# EAGLE design Locoio (EAGLE 4.03)
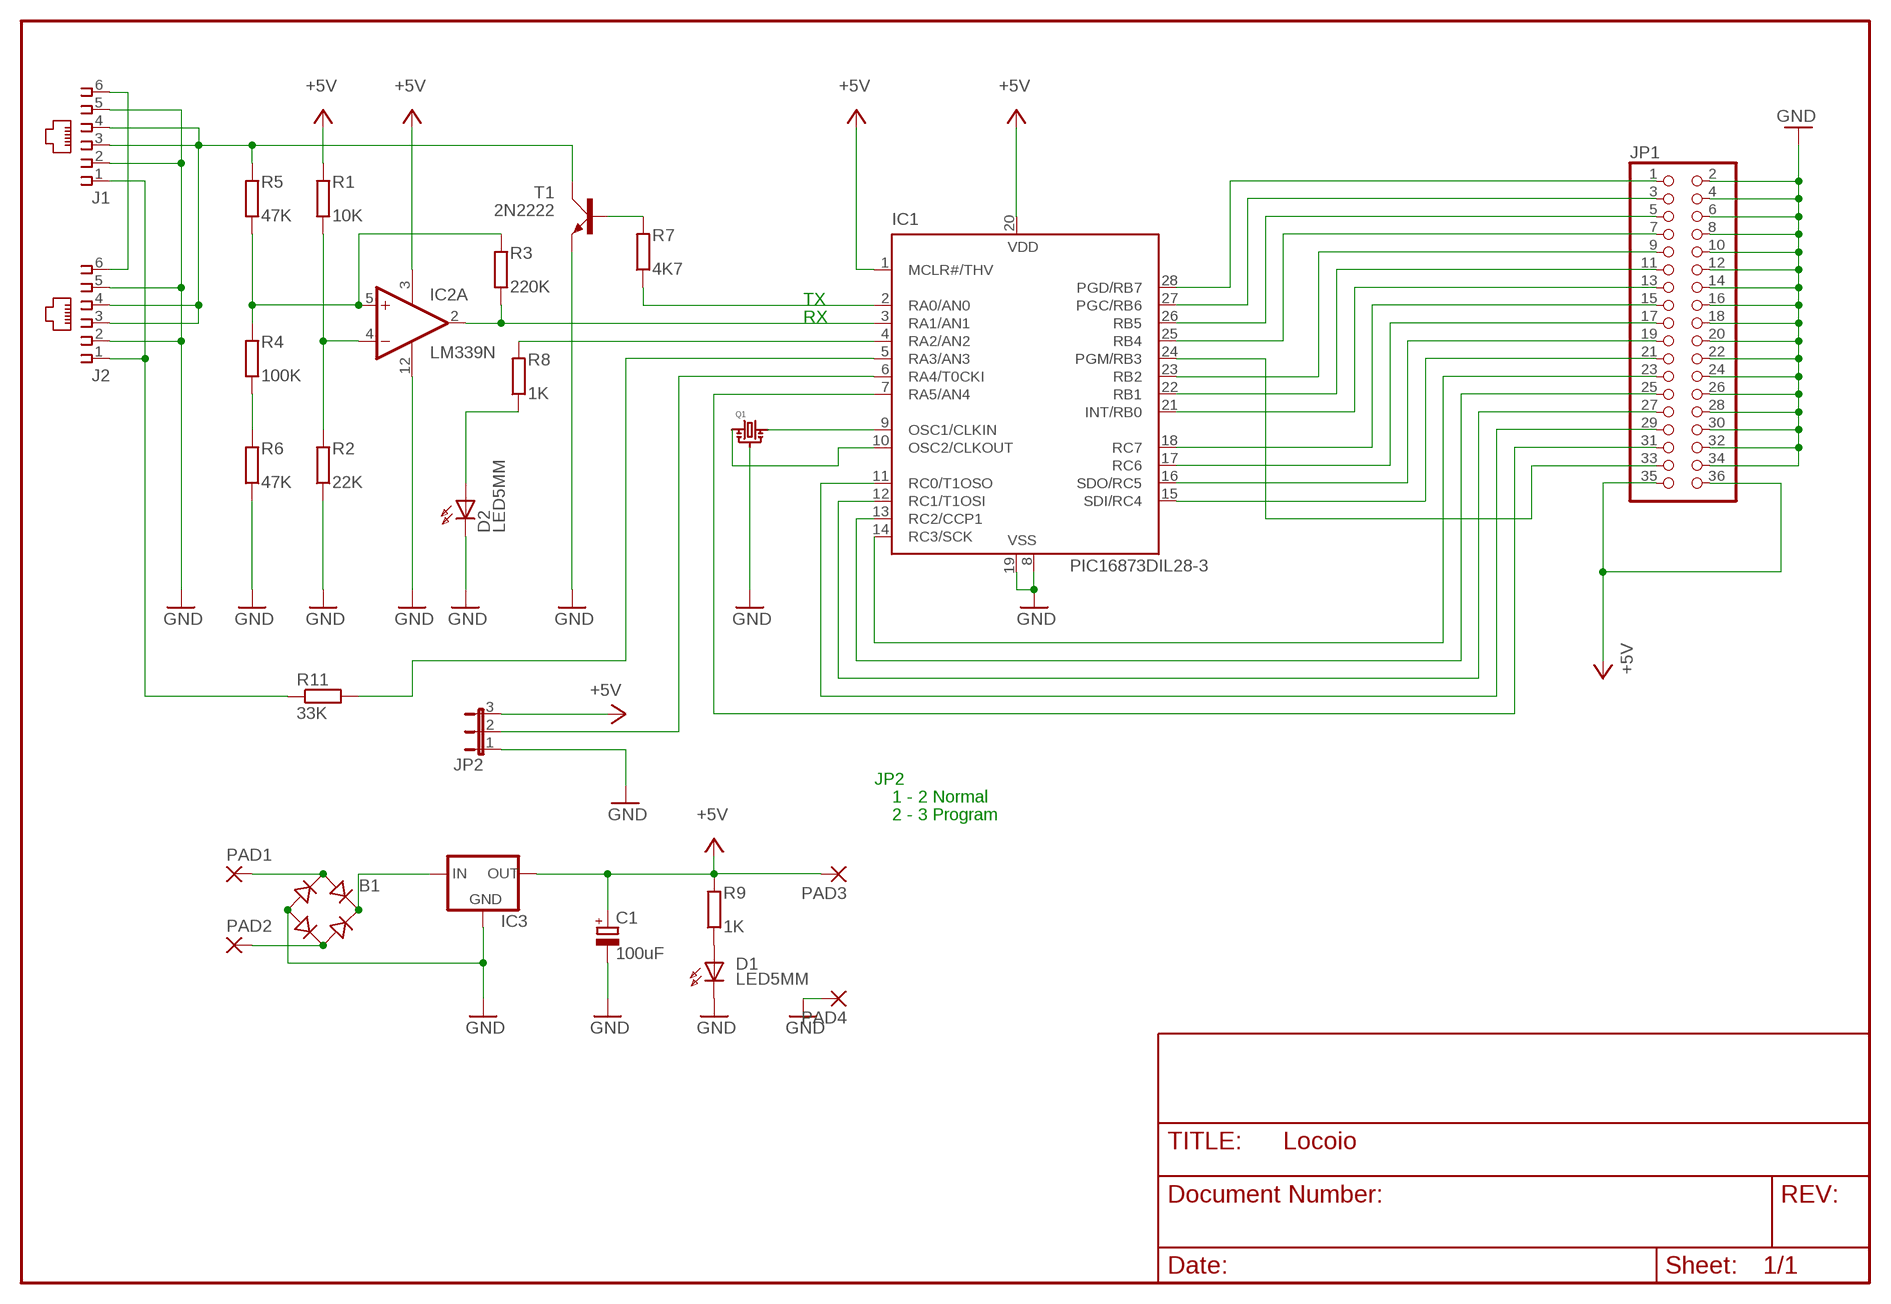
[diagram p0: schematic, sheet 1]

## Parts
B1  B-DIL  [B-DIL]
C1  100uF  CPOL-EUE2.5-7  [E2,5-7]
D1  LED5MM  [LED5MM]
D2  LED5MM  [LED5MM]
IC1  PIC16873DIL28-3  [DIL28-3]
IC2  LM339N  [DIL14]
IC3  78XXS  [78XXS]
J1  520250-3  [520250-3]
J2  520250-3  [520250-3]
JP1  PINHD-2X18  [2X18]
JP2  JP2E  [JP2]
PAD1  2,54/0,8  [2,54/0,8]
PAD2  2,54/0,8  [2,54/0,8]
PAD3  2,54/0,8  [2,54/0,8]
PAD4  2,54/0,8  [2,54/0,8]
Q1  RESOX909"  [X909-ND]
R1  10K  R-EU_0204/7  [0204/7]
R2  22K  R-EU_0204/7  [0204/7]
R3  220K  R-EU_0204/7  [0204/7]
R4  100K  R-EU_0204/7  [0204/7]
R5  47K  R-EU_0204/7  [0204/7]
R6  47K  R-EU_0204/7  [0204/7]
R7  4K7  R-EU_0204/7  [0204/7]
R8  1K  R-EU_0204/7  [0204/7]
R9  1K  R-EU_0204/7  [0204/7]
R11  33K  R-EU_0204/7  [0204/7]
T1  2N2222  [TO18A]

## Nets
+5V: C1.+ IC1.1(MCLR#/THV) IC1.20(VDD) IC2.3(P:V+) IC3.OUT JP1.35 JP1.36 JP2.3 PAD3.1(P) R1.2 R9.2
GND: B1.- C1.- D1.K(C) D2.K(C) IC1.8(VSS) IC1.19(VSS) IC2.12(P:V-) IC3.GND J1.2 J1.5 J2.2 J2.5 JP1.2 JP1.4 JP1.6 JP1.8 JP1.10 JP1.12 JP1.14 JP1.16 JP1.18 JP1.20 JP1.22 JP1.24 JP1.26 JP1.28 JP1.30 JP1.32 JP1.34 JP2.1 PAD4.1(P) Q1.P$2 R2.1 R6.1 T1.E
N$1: J1.3 J1.4 J2.3 J2.4 R5.2 T1.C
N$2: IC1.28(PGD/RB7) JP1.1
N$3: IC1.14(RC3/SCK) JP1.23
N$4: IC2.5(A:+IN) R3.2 R4.2 R5.1
N$5: R4.1 R6.2
N$6: IC1.27(PGC/RB6) JP1.3
N$7: IC2.4(A:-IN) R1.1 R2.2
N$8: IC1.26(RB5) JP1.5
N$9: R7.2 T1.B
N$10: IC1.25(RB4) JP1.7
N$11: IC1.3(RA1/AN1) IC2.2(A:OUT) R3.1
N$12: IC1.2(RA0/AN0) R7.1
N$13: J1.1 J2.1 R11.1
N$14: IC1.23(RB2) JP1.9
N$15: IC1.22(RB1) JP1.11
N$16: IC1.9(OSC1/CLKIN) Q1.P$3
N$17: IC1.10(OSC2/CLKOUT) Q1.P$1
N$18: IC1.4(RA2/AN2) R8.2
N$19: D2.A R8.1
N$20: IC1.21(INT/RB0) JP1.13
N$21: IC1.18(RC7) JP1.15
N$22: IC1.17(RC6) JP1.17
N$23: IC1.16(SDO/RC5) JP1.19
N$25: B1.+ IC3.IN
N$26: D1.A R9.1
N$27: B1.AC2 PAD2.1(P)
N$28: B1.AC1 PAD1.1(P)
N$38: IC1.15(SDI/RC4) JP1.21
N$39: IC1.13(RC2/CCP1) JP1.25
N$40: IC1.24(PGM/RB3) JP1.33
N$41: IC1.12(RC1/T1OSI) JP1.27
N$42: IC1.11(RC0/T1OSO) JP1.29
N$43: J1.6 J2.6
N$45: IC1.7(RA5/AN4) JP1.31
N$48: IC1.6(RA4/T0CKI) JP2.2
N$49: IC1.5(RA3/AN3) R11.2
Unconnected: IC2.1(B:OUT) IC2.6(B:-IN) IC2.7(B:+IN) IC2.8(C:-IN) IC2.9(C:+IN) IC2.10(D:-IN) IC2.11(D:+IN) IC2.13(D:OUT) IC2.14(C:OUT)

## Notes on the sheet
- TX
- RX
- JP2
- 1 - 2 Normal
- 2 - 3 Program

## Library data of the parts
B1 = rectifier:B-DIL: RECTIFIER
C1 = rcl:CPOL-EU: POLARIZED CAPACITOR, European symbol
D1 D2 = led:LED5MM: LED 5 mm, round
IC1 = microchip:PIC16*873: MICROCONTROLLER flash type
IC2 = linear:LM339: COMPARATOR
IC3 = v-reg:78XXS: VOLTAGE REGULATOR
J1 J2 = con-amp:520250-3: AMP CONNECTOR
JP1 = pinhead:PINHD-2X18: PIN HEADER
JP2 = jumper:JP2E: JUMPER
PAD1-PAD4 = wirepad:2,54/0,8: THROUGH-HOLE PAD
Q1 = crystal:RESOX909: Resonator X909-ND
R1-R9 R11 = rcl:R-EU_: RESISTOR, European symbol
T1 = transistor-small-signal:2N2222: NPN TRANSISTOR

## Board
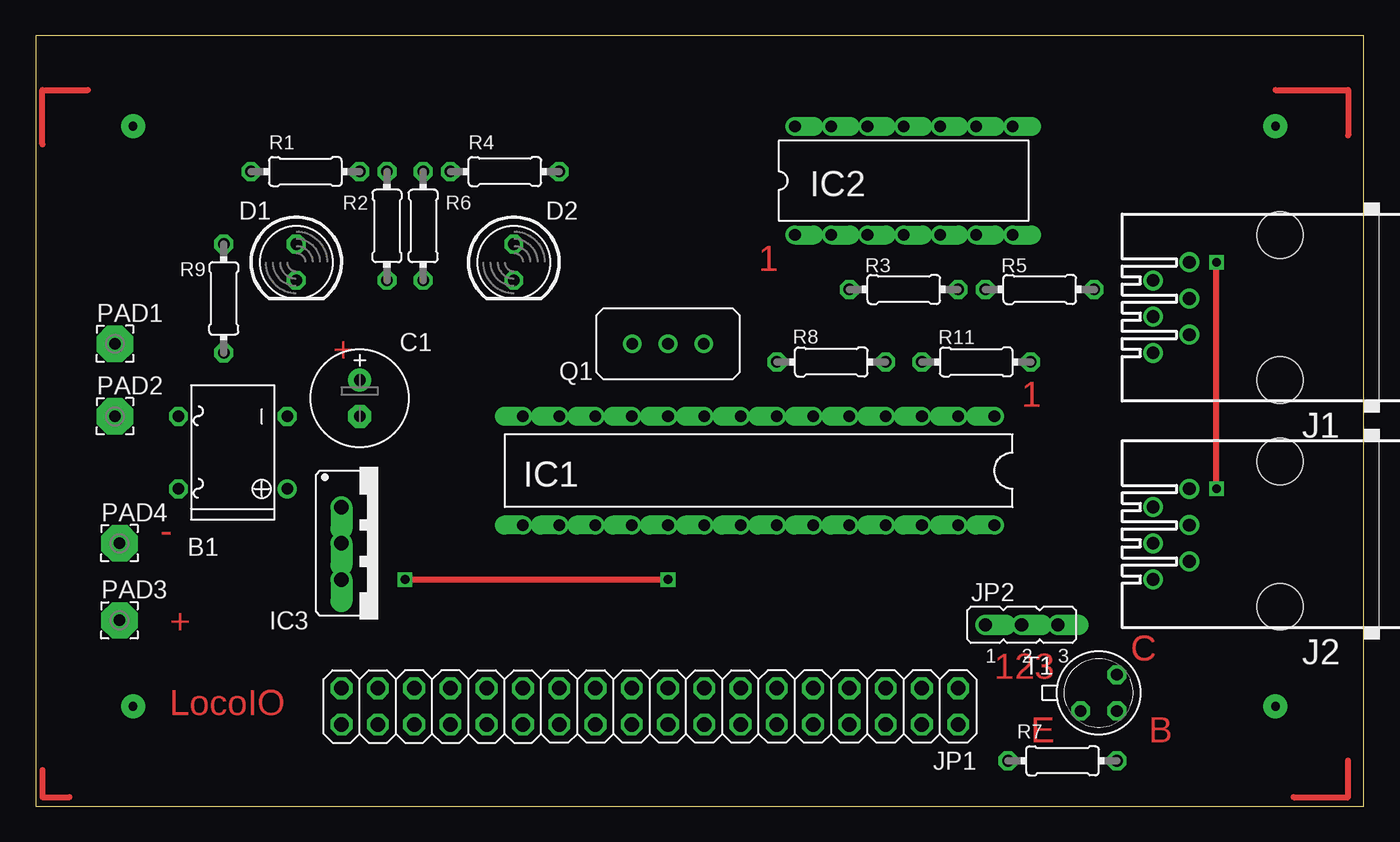
[diagram p1: board, top side]
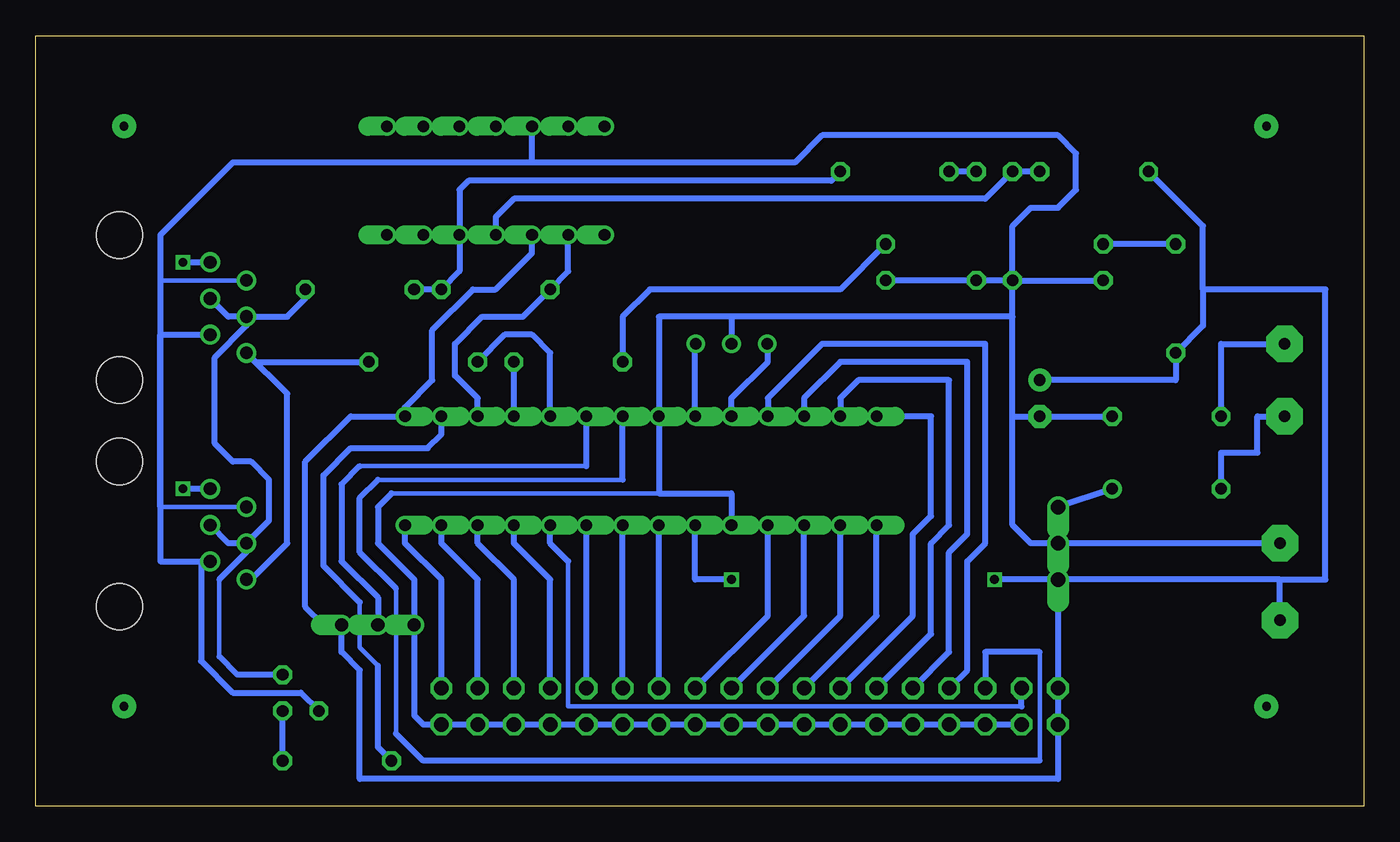
[diagram p2: board, bottom side, seen from below]

Size 93.02 x 53.97 mm. Coordinates in mm from the lower left corner, seen from the top.
Outline: 0,0 93.02,0 93.02,53.97 0,53.97 0,0
Copper layers used: Top, Bottom

### Footprints (pad centres in the part's own frame; a part is rotated, then mirrored left to right if it is on the bottom)
B-DIL = drill 0.813 round: + -2.54,-3.81 | drill 0.813 octagon: - 2.54,-3.81; AC1 2.54,3.81; AC2 -2.54,3.81
E2,5-7 = drill 0.813 pad 1.6 round: + -1.27,0 | drill 0.813 pad 1.6 octagon: - 1.27,0
LED5MM = drill 0.813 octagon: A -1.27,0; K 1.27,0
DIL28-3 = drill 0.813 offset: 1 -16.51,-3.81; 2 -13.97,-3.81; 3 -11.43,-3.81; 4 -8.89,-3.81; 5 -6.35,-3.81; 6 -3.81,-3.81; 7 -1.27,-3.81; 8 1.27,-3.81; 9 3.81,-3.81; 10 6.35,-3.81; 11 8.89,-3.81; 12 11.43,-3.81; 13 13.97,-3.81; 14 16.51,-3.81; 15 16.51,3.81; 16 13.97,3.81; 17 11.43,3.81; 18 8.89,3.81; 19 6.35,3.81; 20 3.81,3.81; 21 1.27,3.81; 22 -1.27,3.81; 23 -3.81,3.81; 24 -6.35,3.81; 25 -8.89,3.81; 26 -11.43,3.81; 27 -13.97,3.81; 28 -16.51,3.81
DIL14 = drill 0.813 offset: 1 -7.62,-3.81; 2 -5.08,-3.81; 3 -2.54,-3.81; 4 0,-3.81; 5 2.54,-3.81; 6 5.08,-3.81; 7 7.62,-3.81; 8 7.62,3.81; 9 5.08,3.81; 10 2.54,3.81; 11 0,3.81; 12 -2.54,3.81; 13 -5.08,3.81; 14 -7.62,3.81
78XXS = drill 1.016 offset: GND 0,-2.54; IN -2.54,-2.54; OUT 2.54,-2.54
520250-3 = drill 0.889 round: 1 -3.175,8.89; 2 -1.905,6.35; 3 -0.635,8.89; 4 0.635,6.35; 5 1.905,8.89; 6 3.175,6.35 | hole 3.251: -5.08,0; 5.08,0
2X18 = drill 1.016 octagon: 1 -21.59,-1.27; 2 -21.59,1.27; 3 -19.05,-1.27; 4 -19.05,1.27; 5 -16.51,-1.27; 6 -16.51,1.27; 7 -13.97,-1.27; 8 -13.97,1.27; 9 -11.43,-1.27; 10 -11.43,1.27; 11 -8.89,-1.27; 12 -8.89,1.27; 13 -6.35,-1.27; 14 -6.35,1.27; 15 -3.81,-1.27; 16 -3.81,1.27; 17 -1.27,-1.27; 18 -1.27,1.27; 19 1.27,-1.27; 20 1.27,1.27; 21 3.81,-1.27; 22 3.81,1.27; 23 6.35,-1.27; 24 6.35,1.27; 25 8.89,-1.27; 26 8.89,1.27; 27 11.43,-1.27; 28 11.43,1.27; 29 13.97,-1.27; 30 13.97,1.27; 31 16.51,-1.27; 32 16.51,1.27; 33 19.05,-1.27; 34 19.05,1.27; 35 21.59,-1.27; 36 21.59,1.27
JP2 = drill 0.914 offset: 1 -2.54,0; 2 0,0; 3 2.54,0
2,54/0,8 = drill 0.813 pad 2.54 octagon: 1 0,0
X909-ND = drill 0.813 round: P$1 -2.5,0; P$2 0,0; P$3 2.5,0
0204/7 = drill 0.813 octagon: 1 -3.81,0; 2 3.81,0
TO18A = drill 0.813 octagon: B 1.27,-1.27; C 1.27,1.27; E -1.27,-1.27

### Placement (x,y rotation side)
B1  13.81,24.76 90 top
C1  22.7,28.57 270 top
D1  18.25,38.1 270 top
D2  33.49,38.1 270 top
IC1  50.63,23.49 180 top
IC2  60.8,43.81 0 top
IC3  23.96,18.41 270 top
J1  87.15,34.92 90 top
J2  87.15,19.04 90 top
JP1  43.02,6.98 180 top
JP2  69.05,12.7 0 top
PAD1  5.55,32.38 0 top
PAD2  5.55,27.3 0 top
PAD3  5.87,13.01 0 top
PAD4  5.87,18.41 0 top
Q1  44.28,32.38 0 top
R1  18.88,44.45 180 top
R2  24.6,40.64 90 top
R3  60.8,36.19 0 top
R4  32.85,44.45 0 top
R5  70.32,36.19 0 top
R6  27.14,40.64 90 top
R7  71.91,3.17 0 top
R8  55.71,31.11 0 top
R9  13.17,35.55 270 top
R11  65.88,31.11 180 top
T1  74.45,7.93 0 top

### Tracks (layer width: path | path; a pad name or v marks a point on that pad's centre or on a via)
+5V  (via drill 0.61)
  Top 0.406: v25.87,15.87 v44.28,15.87
  Bottom 0.406: C1.+ 13.17,29.84 R9.2 11.27,33.65 11.27,36.19 | IC2.3 58.25,38.73 60.8,36.19 62.38,36.19 65.24,33.33 65.24,29.84 67.14,27.93 IC1.1 70.95,27.3 74.13,24.12 74.13,13.97 72.86,12.7 JP2.3 71.59,10.79 70.32,9.52 70.32,1.9 21.42,1.9 JP1.36 JP1.35 | R1.2 11.27,40.64 11.27,36.19 | 5.87,15.87 2.69,15.87 2.69,36.19 11.27,36.19 | 5.87,15.87 IC3.OUT | PAD3.1 5.87,15.87 | JP1.35 21.42,8.57 | IC3.OUT JP1.35 | IC1.20 46.82,15.87 v44.28,15.87 | IC3.OUT v25.87,15.87
GND
  Bottom 0.305: 49.37,21.9 68.1,21.9 | 84.29,36.83 J1.5 | 84.29,20.95 J2.5
  Bottom 0.406: IC1.19 44.28,21.9 49.37,21.9 IC1.8 49.37,34.29 44.28,34.29 | 68.1,21.9 69.05,20.95 69.05,18.41 66.51,15.87 JP2.1 66.51,6.34 65.88,5.71 JP1.2 JP1.4 JP1.6 JP1.8 JP1.10 JP1.12 JP1.14 JP1.16 JP1.18 JP1.20 JP1.22 JP1.24 JP1.26 JP1.28 JP1.30 | 44.28,34.29 Q1.P$2 | B1.- C1.- 24.6,27.3 | 24.6,27.3 24.6,34.29 | 24.6,34.29 44.28,34.29 | R2.1 D1.K | R2.1 R6.1 D2.K | 24.6,34.29 R2.1 | 58.25,45.08 39.84,45.08 37.94,46.98 21.42,46.98 20.15,45.72 20.15,43.18 21.42,41.91 23.33,41.91 24.6,40.64 R2.1 | 58.25,45.08 IC2.12 | 24.6,27.3 24.6,19.68 23.33,18.41 IC3.GND PAD4.1 | 84.29,40 84.29,36.83 84.29,33.02 | 84.29,20.95 84.29,33.02 | 84.29,20.95 84.29,17.14 81.43,17.14 | 84.29,33.02 J1.2 | 81.43,17.14 J2.2 | 84.29,40 84.29,20.95 | 84.29,40 79.21,45.08 58.25,45.08 | T1.E 74.45,7.93 79.21,7.93 81.43,10.16 81.43,17.14 | JP1.30 28.73,5.71 | JP1.32 26.19,5.71 | JP1.30 JP1.32 | 23.65,5.71 JP1.34 JP1.32
N$1
  Bottom 0.305: 80.16,10.47 80.16,15.87
  Bottom 0.406: J1.3 79.53,34.29 J1.4 | J2.3 79.53,18.41 J2.4 | J2.3 78.26,17.77 80.16,15.87 | J1.3 78.26,33.65 80.48,31.43 80.48,25.39 79.21,24.12 77.94,24.12 76.67,22.86 76.67,20 J2.3 | J1.3 75.4,34.29 74.13,35.55 R5.2 | T1.C 78.89,9.2 80.16,10.47
N$2
  Bottom 0.406: IC1.28 67.14,18.41 64.61,15.87 JP1.1
N$3
  Bottom 0.406: IC1.14 30.31,27.3 30.31,20.31 31.58,19.04 31.58,13.33 JP1.23
N$4
  Bottom 0.406: R5.1 R3.2 63.34,37.46 IC2.5 63.34,43.18 62.7,43.81 37.3,43.81 R4.2
N$5
  Bottom 0.406: R6.2 R4.1
N$6
  Bottom 0.406: IC1.27 64.61,18.41 62.06,15.87 JP1.3
N$7
  Bottom 0.406: R1.1 R2.2 26.5,42.54 59.52,42.54 60.8,41.27 IC2.4
N$8
  Bottom 0.406: IC1.26 62.06,18.41 59.52,15.87 JP1.5
N$9
  Bottom 0.406: R7.2 T1.B
N$10
  Bottom 0.406: IC1.25 59.52,18.41 56.98,15.87 JP1.7
N$11
  Bottom 0.406: IC2.2 55.71,37.46 R3.1 58.89,34.29 61.75,34.29 63.65,32.38 63.65,30.16 62.06,28.57 IC1.3
N$12
  Bottom 0.305: 70.32,14.28 70.32,11.11 69.05,9.84
  Bottom 0.406: IC1.2 64.61,26.03 65.56,25.08 70.95,25.08 72.86,23.17 72.86,16.82 70.32,14.28 | 69.05,9.84 69.05,4.12 R7.1
N$13
  Bottom 0.406: 69.69,30.79 R11.1 77.62,31.11 J1.1 75.4,28.89 75.4,18.41 77.94,15.87 J2.1
N$14
  Bottom 0.406: JP1.9 IC1.23
N$15
  Bottom 0.406: JP1.11 IC1.22
N$16
  Bottom 0.406: Q1.P$3 46.82,32.38 IC1.9
N$17
  Bottom 0.406: IC1.10 44.28,28.57 41.74,31.11 41.74,32.38 Q1.P$1
N$18
  Bottom 0.406: IC1.4 R8.2
N$19
  Bottom 0.406: D2.A 36.66,36.19 50,36.19 51.91,34.29 R8.1
N$20
  Bottom 0.406: JP1.13 IC1.21
N$21
  Bottom 0.406: IC1.18 41.74,13.33 JP1.15
N$22
  Bottom 0.406: IC1.17 39.2,13.33 JP1.17
N$23
  Bottom 0.406: IC1.16 36.66,13.33 JP1.19
N$24
  Top 0.406: 0.47,2.54 0.47,0.63 2.38,0.63
N$25
  Bottom 0.406: B1.+ IC3.IN
N$26
  Bottom 0.406: R9.1 D1.A
N$27
  Bottom 0.406: PAD2.1 7.46,27.3 7.46,24.76 10,24.76 B1.AC2
N$28
  Bottom 0.406: PAD1.1 10,32.38 B1.AC1
N$29
  Top 0.406: 0.47,46.35 0.47,50.16 3.64,50.16
N$30  (via drill 0.61 pad 1.68)
  other vias: 6.82,6.98
N$31  (via drill 0.61 pad 1.68)
  other vias: 86.83,6.98
N$32  (via drill 0.61 pad 1.68)
  other vias: 6.82,47.62
N$33  (via drill 0.61 pad 1.68)
  other vias: 86.83,47.62
N$34  (via drill 0.61 pad 1.68)
  other vias: 87.15,40
N$35  (via drill 0.61 pad 1.68)
  other vias: 87.15,29.84
N$36  (via drill 0.61 pad 1.68)
  other vias: 87.15,24.12
N$37  (via drill 0.61 pad 1.68)
  other vias: 87.15,13.97
N$38
  Bottom 0.406: IC1.15 34.12,13.33 JP1.21
N$39
  Bottom 0.406: IC1.13 36.66,28.57 35.39,29.84 29.04,29.84 29.04,19.68 30.31,18.41 30.31,12.06 JP1.25
N$40
  Bottom 0.305: 55.71,17.14 55.71,6.98 23.96,6.98
  Bottom 0.406: IC1.24 56.98,18.41 55.71,17.14 | 23.96,6.98 JP1.33
N$41
  Bottom 0.406: IC1.12 39.2,28.57 36.66,31.11 27.77,31.11 27.77,19.04 29.04,17.77 29.04,10.79 JP1.27
N$42
  Bottom 0.406: IC1.11 41.74,28.57 37.94,32.38 26.5,32.38 26.5,18.41 27.77,17.14 27.77,9.52 JP1.29
N$43  (via drill 0.61)
  Top 0.406: v82.7,22.22 v82.7,38.1
  Bottom 0.406: J2.6 v82.7,22.22 | v82.7,38.1 J1.6
N$44
  Top 0.406: 88.1,0.63 91.91,0.63 91.91,3.17
N$45
  Bottom 0.305: 22.7,3.17 22.7,10.79 | 69.05,22.86 51.91,22.86 | 67.78,5.08 67.78,15.24
  Bottom 0.406: 22.7,10.79 26.5,10.79 JP1.31 | 22.7,3.17 65.88,3.17 67.78,5.08 | 51.91,22.86 IC1.7 | 69.05,22.86 70.32,21.58 70.32,17.77 67.78,15.24
N$46
  Top 0.406: 86.83,50.16 91.91,50.16 91.91,46.98
N$48
  Bottom 0.305: 54.45,23.81 70.32,23.81
  Bottom 0.406: 54.45,23.81 IC1.6 | 70.32,23.81 71.59,22.54 71.59,17.14 69.05,14.6 JP2.2
N$49
  Bottom 0.406: IC1.5 56.98,31.74 58.25,33.02 60.16,33.02 R11.2

### Text on the board
Top: 1 | + | 1 | - | + | C | 123 | LocoIO | E | B
tValues: AC | - | DC | +
bDocu: Loco_IO